# EAGLE design Controller (EAGLE 7.7.0)
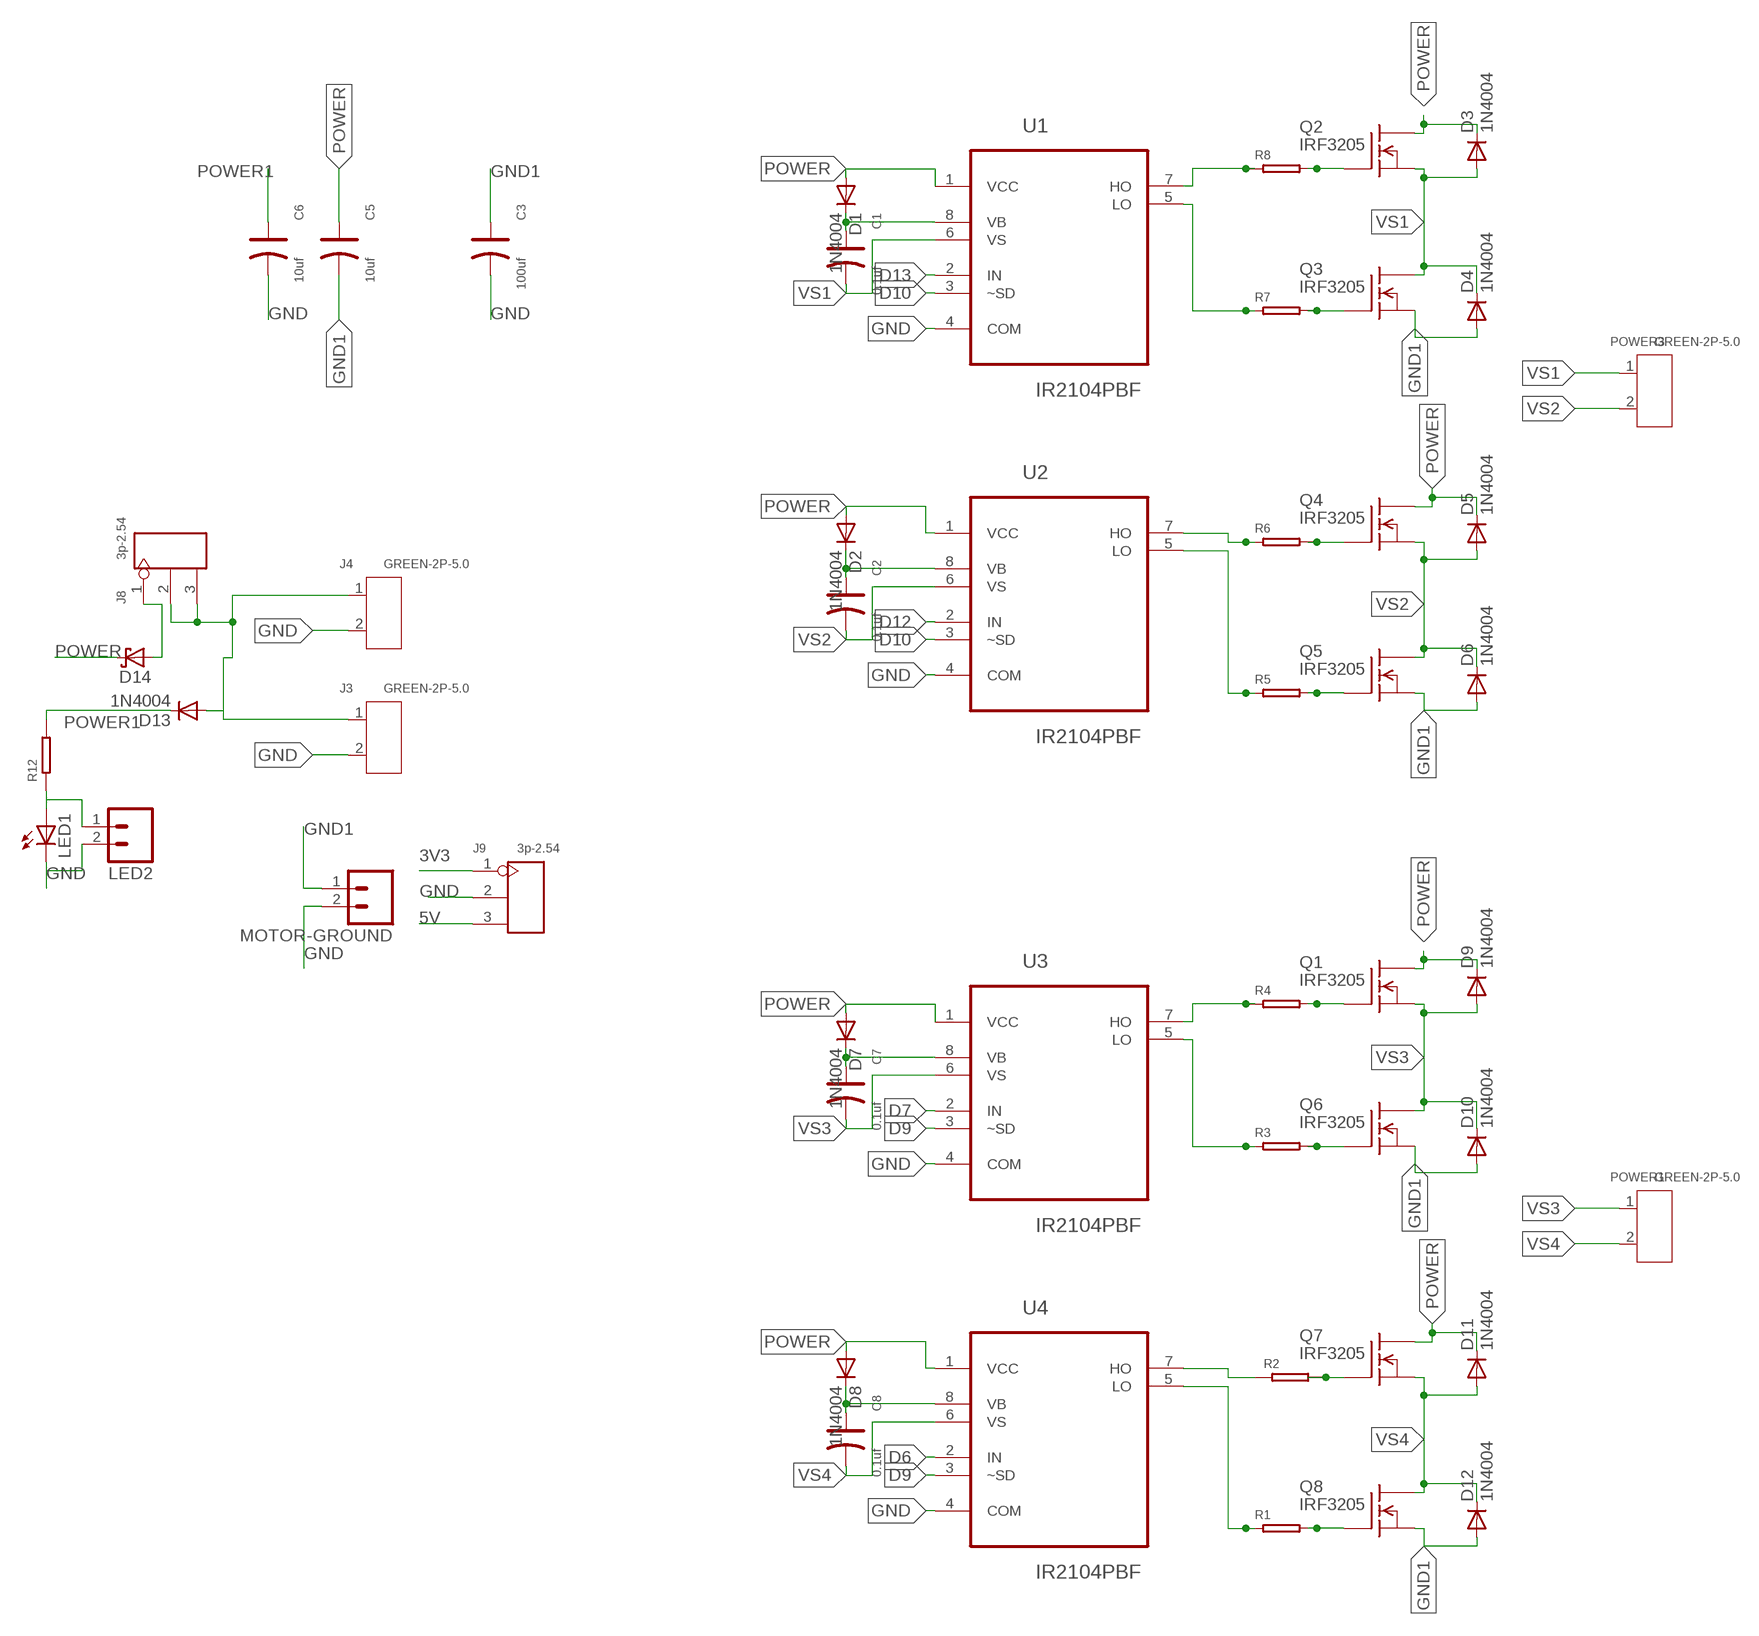
[diagram p0: schematic, sheet 1, part 1 of 2]
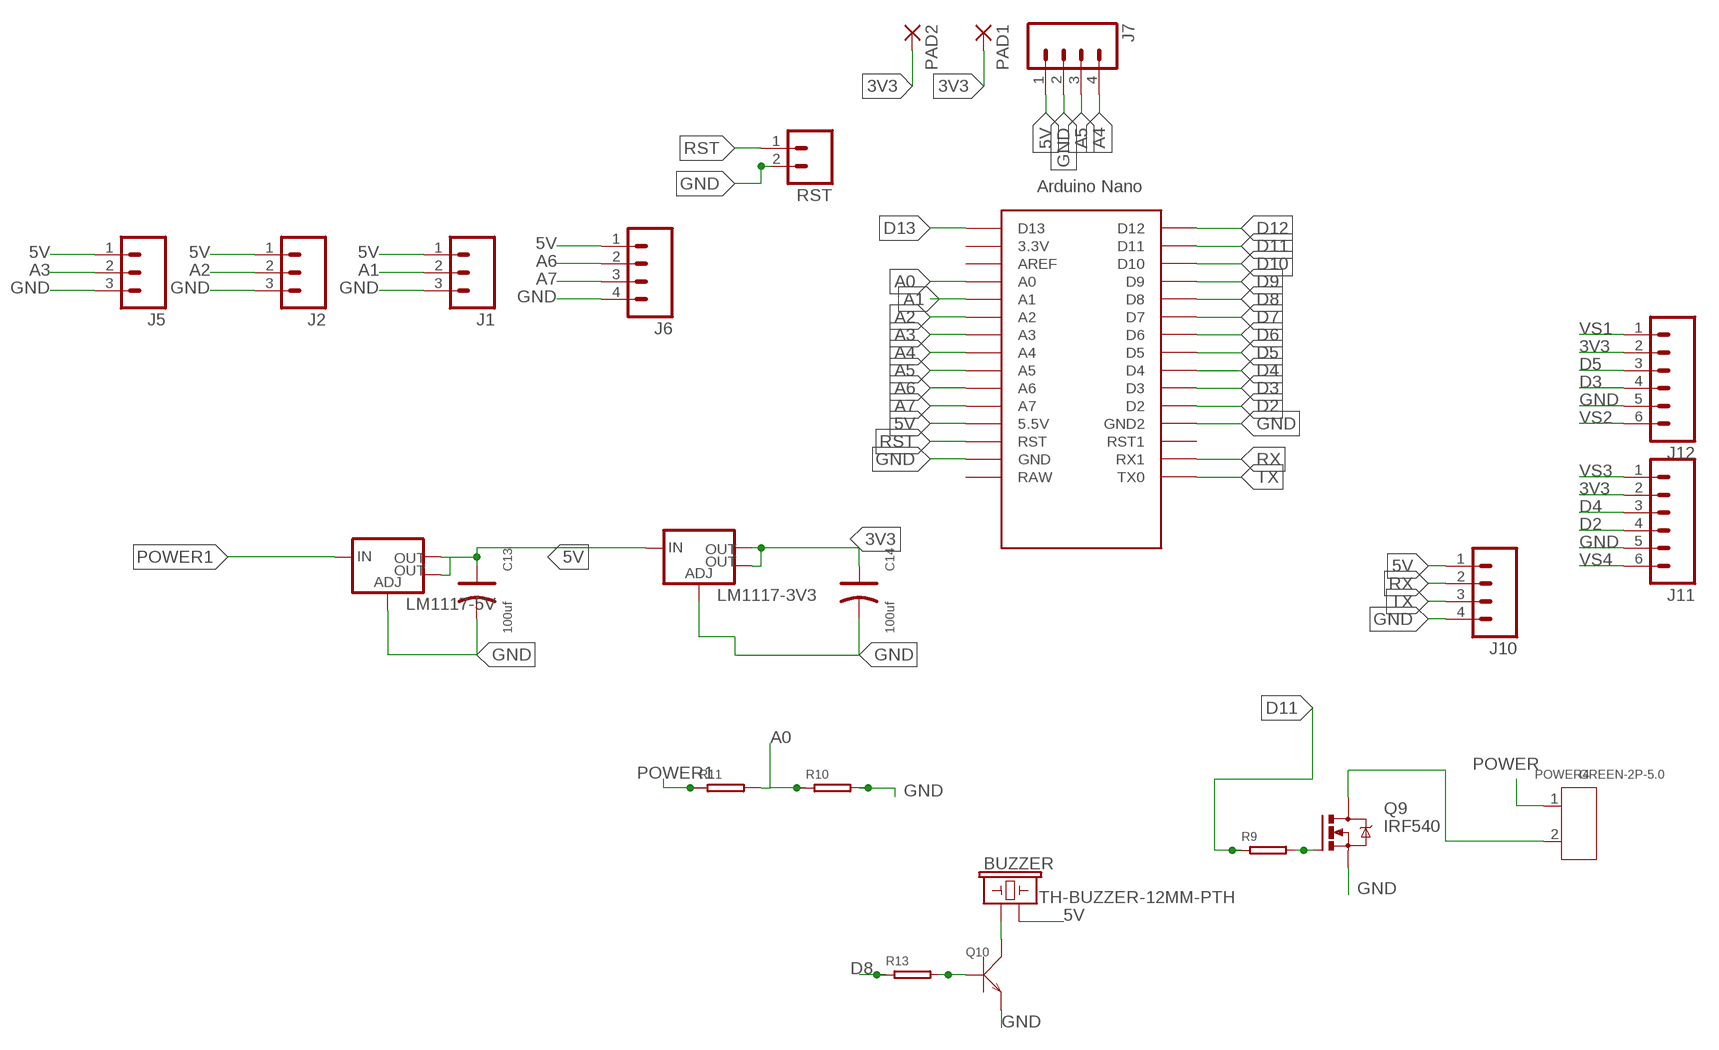
[diagram p1: schematic, sheet 1, part 2 of 2]

## Parts
BUZZER  TH-BUZZER-12MM-PTH  [BUZZER-12MM]
C1  0.1uf  DIP-ALUMINUM-100UF-16V(D5-H7MM)  [PC-D5.3MM]
C2  0.1uf  DIP-ALUMINUM-100UF-16V(D5-H7MM)  [PC-D5.3MM]
C3  100uf  DIP-ALUMINUM-100UF-16V(D5-H7MM)  [PC-D5.3MM]
C5  10uf  DIP-ALUMINUM-100UF-16V(D5-H7MM)  [PC-D5.3MM]
C6  10uf  DIP-ALUMINUM-100UF-16V(D5-H7MM)  [PC-D5.3MM]
C7  0.1uf  DIP-ALUMINUM-100UF-16V(D5-H7MM)  [PC-D5.3MM]
C8  0.1uf  DIP-ALUMINUM-100UF-16V(D5-H7MM)  [PC-D5.3MM]
C13  100uf  DIP-ALUMINUM-100UF-16V(D5-H7MM)  [PC-D5.3MM]
C14  100uf  DIP-ALUMINUM-100UF-16V(D5-H7MM)  [PC-D5.3MM]
D1  1N4004  [DO41-10]
D2  1N4004  [DO41-10]
D3  1N4004  [DO41-10]
D4  1N4004  [DO41-10]
D5  1N4004  [DO41-10]
D6  1N4004  [DO41-10]
D7  1N4004  [DO41-10]
D8  1N4004  [DO41-10]
D9  1N4004  [DO41-10]
D10  1N4004  [DO41-10]
D11  1N4004  [DO41-10]
D12  1N4004  [DO41-10]
D13  1N4004  [DO41-10]
D14  SCHOTTKY-DIODEDO201T15  [DO201T15]
J1  M03POLAR  [MOLEX-1X3]
J2  M03POLAR  [MOLEX-1X3]
J3  GREEN-2P-5.0  SCREW-TERMINAL-GREEN(2P-5.0)  [H2-5.0-10.5X8.0MM]
J4  GREEN-2P-5.0  SCREW-TERMINAL-GREEN(2P-5.0)  [H2-5.0-10.5X8.0MM]
J5  M03POLAR  [MOLEX-1X3]
J6  M04POLAR  [MOLEX-1X4]
J7  M04POLAR  [MOLEX-1X4]
J8  3p-2.54  DIP-BLACK-FEMALE-HEADER-VERT(3P-2.54)  [H3-2.54]
J9  3p-2.54  DIP-BLACK-FEMALE-HEADER-VERT(3P-2.54)  [H3-2.54]
J10  M04POLAR  [MOLEX-1X4]
J11  M06POLAR  [MOLEX-1X6]
J12  M06POLAR  [MOLEX-1X6]
LED1  LEDCHIPLED_0603  [CHIPLED_0603]
LED2  M02PTH  [1X02]
LM1117-3V3  V_REG_LM1117SOT223  [SOT223]
LM1117-5V  V_REG_LM1117SOT223  [SOT223]
MOTOR-GROUND  M02PTH  [1X02]
PAD1  2,15/1,0  [2,15/1,0]
PAD2  2,15/1,0  [2,15/1,0]
POWER1  GREEN-2P-5.0  SCREW-TERMINAL-GREEN(2P-5.0)  [H2-5.0-10.5X8.0MM]
POWER3  GREEN-2P-5.0  SCREW-TERMINAL-GREEN(2P-5.0)  [H2-5.0-10.5X8.0MM]
POWER4  GREEN-2P-5.0  SCREW-TERMINAL-GREEN(2P-5.0)  [H2-5.0-10.5X8.0MM]
Q1  IRF3205  IRF540  [TO220]
Q2  IRF3205  IRF540  [TO220]
Q3  IRF3205  IRF540  [TO220]
Q4  IRF3205  IRF540  [TO220]
Q5  IRF3205  IRF540  [TO220]
Q6  IRF3205  IRF540  [TO220]
Q7  IRF3205  IRF540  [TO220]
Q8  IRF3205  IRF540  [TO220]
Q9  IRF540  [TO220BV]
Q10  SMD-TRANSISTOR-NPN-SOT-23  [SOT-23]
R1  SMD-RESISTOR-0603  [R0603]
R2  SMD-RESISTOR-0603  [R0603]
R3  SMD-RESISTOR-0603  [R0603]
R4  SMD-RESISTOR-0603  [R0603]
R5  SMD-RESISTOR-0603  [R0603]
R6  SMD-RESISTOR-0603  [R0603]
R7  SMD-RESISTOR-0603  [R0603]
R8  SMD-RESISTOR-0603  [R0603]
R9  SMD-RESISTOR-0603  [R0603]
R10  SMD-RESISTOR-0603  [R0603]
R11  SMD-RESISTOR-0603  [R0603]
R12  SMD-RESISTOR-0603  [R0603]
R13  SMD-RESISTOR-0603  [R0603]
RST  M02PTH  [1X02]
U1  IR2104PBF  [DIP254P762X533-8]
U2  IR2104PBF  [DIP254P762X533-8]
U3  IR2104PBF  [DIP254P762X533-8]
U4  IR2104PBF  [DIP254P762X533-8]
U$1  NANO  [NANO]

## Nets
3V3: C14.+ J9.1 J11.2 J12.2 LM1117-3V3.2(OUT) LM1117-3V3.4(OUT) PAD1.1(P) PAD2.1(P)
5V: BUZZER.- C13.+ J1.1 J2.1 J5.1 J6.1 J7.1 J9.3 J10.1 LM1117-3V3.3(IN) LM1117-5V.2(OUT) LM1117-5V.4(OUT) U$1.5V(5.5V)
A0: R10.1 R11.2 U$1.A0
A1: J1.2 U$1.A1
A2: J2.2 U$1.A2
A3: J5.2 U$1.A3
A4: J7.4 U$1.A4
A5: J7.3 U$1.A5
A6: J6.2 U$1.A6
A7: J6.3 U$1.A7
D2: J11.4 U$1.D2
D3: J12.4 U$1.D3
D4: J11.3 U$1.D4
D5: J12.3 U$1.D5
D6: U4.2(IN) U$1.D6
D7: U3.2(IN) U$1.D7
D8: R13.1 U$1.D8
D9: U3.3(~SD) U4.3(~SD) U$1.D9
D10: U1.3(~SD) U2.3(~SD) U$1.D10
D11: R9.1 U$1.D11
D12: U2.2(IN) U$1.D12
D13: U1.2(IN) U$1.D13
GND: C3.- C6.- C13.- C14.- J1.3 J2.3 J3.2 J4.2 J5.3 J6.4 J7.2 J9.2 J10.4 J11.5 J12.5 LED1.C LED2.2 LM1117-3V3.1(ADJ) LM1117-5V.1(ADJ) MOTOR-GROUND.2 Q9.S Q10.2(E) R10.2 RST.2 U1.4(COM) U2.4(COM) U3.4(COM) U4.4(COM) U$1.GND U$1.GND1(GND2)
GND1: C3.+ C5.- D4.A D6.A D10.A D12.A MOTOR-GROUND.1 Q3.3(S) Q5.3(S) Q6.3(S) Q8.3(S)
N$1: Q3.1(G) R7.2
N$2: C1.+ D1.C U1.8(VB)
N$3: Q4.1(G) R6.2
N$4: C2.+ D2.C U2.8(VB)
N$5: Q5.1(G) R5.2
N$6: Q2.1(G) R8.2
N$7: R8.1 U1.7(HO)
N$8: R7.1 U1.5(LO)
N$9: R6.1 U2.7(HO)
N$10: R5.1 U2.5(LO)
N$11: C7.+ D7.C U3.8(VB)
N$12: C8.+ D8.C U4.8(VB)
N$13: Q7.1(G) R2.2
N$14: Q8.1(G) R1.2
N$15: Q1.1(G) R4.2
N$16: R4.1 U3.7(HO)
N$17: R3.1 U3.5(LO)
N$18: R2.1 U4.7(HO)
N$19: R1.1 U4.5(LO)
N$20: Q6.1(G) R3.2
N$21: D13.A J3.1 J4.1 J8.2 J8.3
N$22: Q9.G R9.2
N$23: LED1.A LED2.1 R12.1
N$24: POWER4.2 Q9.D
N$25: Q10.1(B) R13.2
N$26: BUZZER.+ Q10.3(C)
N$28: D14.A J8.1
POWER: C5.+ D1.A D2.A D3.C D5.C D7.A D8.A D9.C D11.C D14.C POWER4.1 Q1.2(D) Q2.2(D) Q4.2(D) Q7.2(D) U1.1(VCC) U2.1(VCC) U3.1(VCC) U4.1(VCC)
POWER1: C6.+ D13.C LM1117-5V.3(IN) R11.1 R12.2
RST: RST.1 U$1.RST
RX: J10.2 U$1.RX1
TX: J10.3 U$1.TX0
VS1: C1.- D3.A D4.C J12.1 POWER3.1 Q2.3(S) Q3.2(D) U1.6(VS)
VS2: C2.- D5.A D6.C J12.6 POWER3.2 Q4.3(S) Q5.2(D) U2.6(VS)
VS3: C7.- D9.A D10.C J11.1 POWER1.1 Q1.3(S) Q6.2(D) U3.6(VS)
VS4: C8.- D11.A D12.C J11.6 POWER1.2 Q7.3(S) Q8.2(D) U4.6(VS)
Unconnected: U$1.3.3V U$1.AREF U$1.RAW U$1.RST1

## Library data of the parts
BUZZER = EjaadTech:TH-BUZZER-12MM
C1 C2 C5-C8 = Seeed-Capacitor-2016:DIP-ALUMINUM-100UF-16V(D5-H7MM): 302030031; MPN: KS 100uF/16V; VALUE: 100uf
C3 C13 C14 = Seeed-Capacitor-2016:DIP-ALUMINUM-100UF-16V(D5-H7MM): 302030031; MPN: KS 100uF/16V
D1-D13 = adafruit:1N4004: DIODE General purpose 1N400x type rectifier (With bigger pads) http://www.ladyada.net/library/pcb/eaglelibrary.html
D14 = adafruit:SCHOTTKY-DIODE: Schottky Diode
J1 J2 J5 = SparkFun-Connectors:M03: Header 3 Standard 3-pin 0.1" header. Use with straight break away headers (SKU : PRT-00116), right angle break away headers (PRT-00553), swiss pins (PRT-00743), machine pins (PRT-00117), and female headers (PRT-00115). Molex polarized connector foot print use with SKU : PRT-08232 with associated crimp pins and housings.
J3 J4 = Seeed-OPL-Connector:SCREW-TERMINAL-GREEN(2P-5.0): 320110031
J6 J7 J10 = SparkFun-Connectors:M04: Header 4 Standard 4-pin 0.1" header. Use with straight break away headers (SKU : PRT-00116), right angle break away headers (PRT-00553), swiss pins (PRT-00743), machine pins (PRT-00117), and female headers (PRT-00115). Molex polarized connector foot print use with SKU : PRT-08231 with associated crimp pins and housings. 1MM SMD Version SKU: PRT-10208
J8 J9 = Seeed-OPL-Connector:DIP-BLACK-FEMALE-HEADER-VERT(3P-2.54): 320030024; MPN: F185-1103A0BSYA1
J11 J12 = SparkFun-Connectors:M06: Header 6 Standard 6-pin 0.1" header. Use with straight break away headers (SKU : PRT-00116), right angle break away headers (PRT-00553), swiss pins (PRT-00743), machine pins (PRT-00117), and female headers (PRT-00115). Molex polarized connector foot print use with SKU : PRT-08094 with associated crimp pins and housings. NOTES ON THE VARIANTS LOCK and LOCK_LONGPADS... This footprint was designed to help hold the alignment of a through-hole component (i.e. 6-pin header) while soldering it into place. You may notice that each hole has been shifted either up or down by 0.005 of an inch from it's more standard position (which is a perfectly straight line). This slight alteration caused the pins (the squares in the middle) to touch the edges of the holes. Because they are alternating, it causes a "brace" to hold the component in place. 0.005 has proven to be the perfect amount of "off-center" position when using our standard breakaway headers. Although looks a little odd when you look at the bare footprint, once you have a header in there, the alteration is very hard to notice. Also,if you push a header all the way into place, it is covered up entirely on the bottom side. This idea of altering the position of holes to aid alignment will be further integrated into the Sparkfun Library for other footprints. It can help hold any component with 3 or more connection pins.
LED1 = adafruit:LED: LED OSRAM: - CHIPLED LG R971, LG N971, LY N971, LG Q971, LY Q971, LO R971, LY R971 LH N974, LH R974 LS Q976, LO Q976, LY Q976 LO Q996 - Hyper CHIPLED LW Q18S LB Q993, LB Q99A, LB R99A - SideLED LS A670, LO A670, LY A670, LG A670, LP A670 LB A673, LV A673, LT A673, LW A673 LH A674 LY A675 LS A676, LA A676, LO A676, LY A676, LW A676 LS A679, LY A679, LG A679 - Hyper Micro SIDELED® LS Y876, LA Y876, LO Y876, LY Y876 LT Y87S - SmartLED LW L88C, LW L88S LB L89C, LB L89S, LG L890 LS L89K, LO L89K, LY L89K LS L896, LA L896, LO L896, LY L896 - TOPLED LS T670, LO T670, LY T670, LG T670, LP T670 LSG T670, LSP T670, LSY T670, LOP T670, LYG T670 LG T671, LOG T671, LSG T671 LB T673, LV T673, LT T673, LW T673 LH T674 LS T676, LA T676, LO T676, LY T676, LB T676, LH T676, LSB T676, LW T676 LB T67C, LV T67C, LT T67C, LS T67K, LO T67K, LY T67K, LW E67C LS E67B, LA E67B, LO E67B, LY E67B, LB E67C, LV E67C, LT E67C LW T67C LS T679, LY T679, LG T679 LS T770, LO T770, LY T770, LG T770, LP T770 LB T773, LV T773, LT T773, LW T773 LH T774 LS E675, LA E675, LY E675, LS T675 LS T776, LA T776, LO T776, LY T776, LB T776 LHGB T686 LT T68C, LB T68C - Hyper Mini TOPLED® LB M676 - Mini TOPLED Santana® LG M470 LS M47K, LO M47K, LY M47K Source: http://www.osram.convergy.de/
LED2 MOTOR-GROUND RST = SparkFun-Connectors:M02: Standard 2-pin 0.1" header. Use with - straight break away headers ( PRT-00116) - right angle break away headers (PRT-00553) - swiss pins (PRT-00743) - machine pins (PRT-00117) - female headers (PRT-00115) Molex polarized connector foot print use with: PRT-08233 with associated crimp pins and housings. 2.54_SCREWTERM for use with PRT-10571. 3.5mm Screw Terminal footprints for PRT-08084 5mm Screw Terminal footprints for use with PRT-08432
LM1117-3V3 LM1117-5V = SparkFun-PowerIC:V_REG_LM1117: Voltage Regulator LM1117 Standard adjustable voltage regulator but in SMD form. Spark Fun Electronics SKU : COM-00595; PROD_ID: VREG-08170
PAD1 PAD2 = wirepad:2,15/1,0: THROUGH-HOLE PAD
POWER1 POWER3 POWER4 = Seeed-Connector -2016:SCREW-TERMINAL-GREEN(2P-5.0): 320110031
Q1-Q8 = transistor-fet:IRF540: N-Channel Enhancement MOSFET (HEXFET); 100V; 28A; 0,077Ohm
Q9 = transistor-power:IRF540: HEXFET Power MOSFET
Q10 = EjaadTech:SMD-TRANSISTOR-NPN-SOT-23
R1-R13 = EjaadTech:SMD-RESISTOR-0603
U1-U4 = International_Rectifier_By_element14_Batch_1:IR2104PBF: HALF BRIDGE DRIVER; MPN: IR2104PBF; OC_FARNELL: 8638748; OC_NEWARK: 63J7843; PACKAGE: PDIP; SUPPLIER: INTERNATIONAL RECTIFIER
U$1 = Arduino-clone:NANO: Arduino Nano

## Board
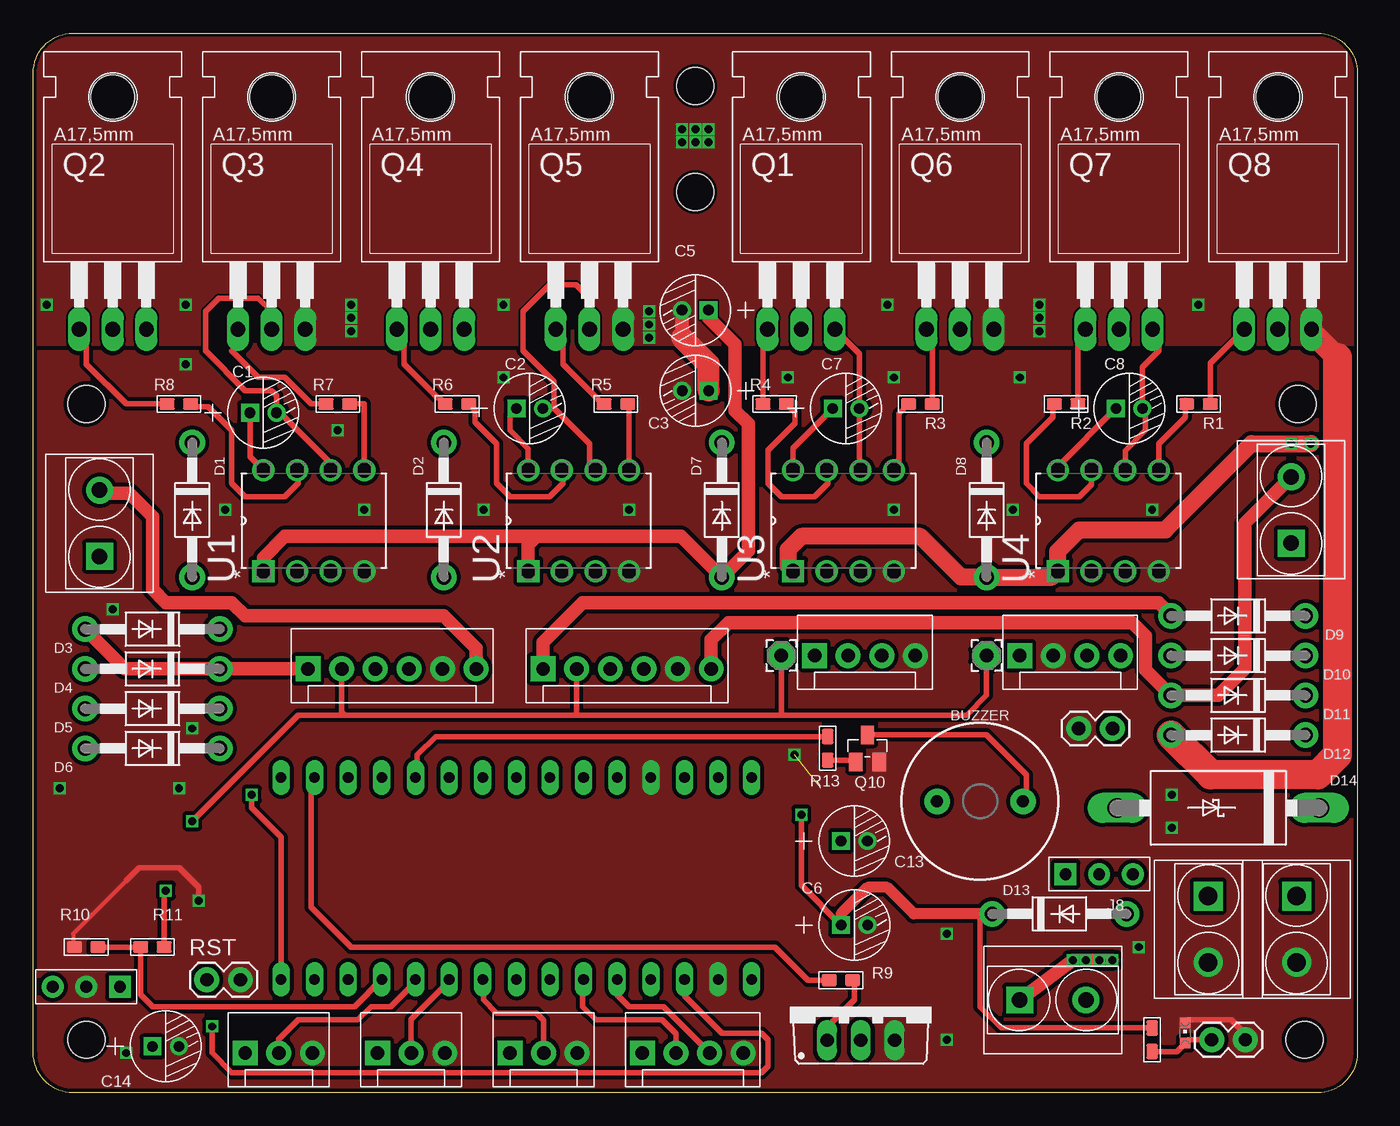
[diagram p2: board, top side]
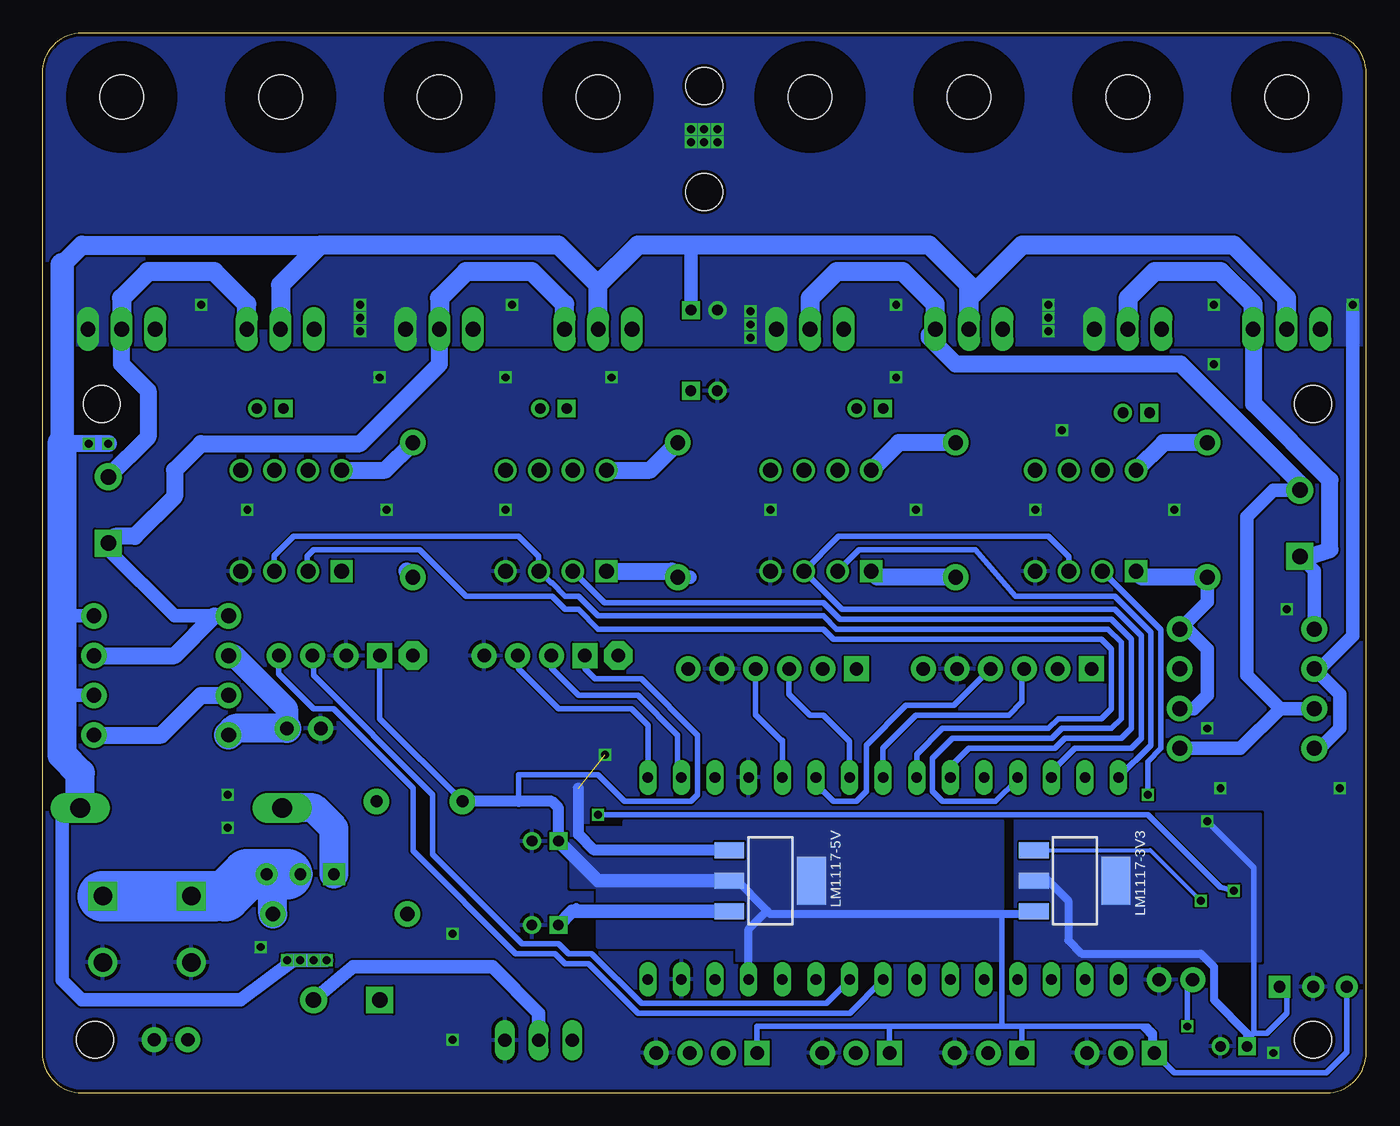
[diagram p3: board, bottom side, seen from below]

Size 100 x 80 mm. Coordinates in mm from the lower left corner, seen from the top.
Outline: 97,80 arc-90 100,77 100,3 arc-90 97,0 3,0 arc-90 0,3 0,77 arc-90 3,80 97,80
Copper layers (1*16): Top 0.035mm / dielectric 1.5mm / Bottom 0.035mm
Design rules "SeeedStudio_2layer_DRU_no_angle_20140221": minimum track width 6mil, minimum drill 12mil, track to track 6mil, track to pad 6mil, pad to pad 6mil, via to via 6mil, smd to smd 0mil, copper to edge 10mil, drill to drill 10mil, minimum pad ring 10mil, minimum via ring 6mil, stop-mask expansion 2mil, vias tented up to drill 100mil, thermal gap 10mil
Holes 2.8 mm at 4,52 95.5,52 50,76 50,68 96,4 4,4

### Footprints (pad centres in the part's own frame; a part is rotated, then mirrored left to right if it is on the bottom)
BUZZER-12MM = drill 0.9 pad 1.93: + 3.25,0; - -3.25,0
PC-D5.3MM = drill 0.8 pad 1.35 square: + -1,0 | drill 0.8 pad 1.35: - 1,0
DO41-10 = drill 1.118 pad 1.93: A 5.08,0; C -5.08,0
DO201T15 = drill 1.499 long: A 7.62,0; C -7.62,0
MOLEX-1X3 = drill 1.016 pad 1.88 square: 1 0,0 | drill 1.016 pad 1.88: 2 2.54,0; 3 5.08,0
H2-5.0-10.5X8.0MM = drill 1.4 pad 2.184 square: 1 0,2.5 | drill 1.4 pad 2.184: 2 0,-2.5
MOLEX-1X4 = drill 1.016 pad 1.88 square: 1 0,0 | drill 1.016 pad 1.88: 2 2.54,0; 3 5.08,0; 4 7.62,0
H3-2.54 = drill 0.889 pad 1.651 square: 1 0,2.54 | drill 0.889 pad 1.651: 2 0,0; 3 0,-2.54
MOLEX-1X6 = drill 1.016 pad 1.88 square: 1 0,0 | drill 1.016 pad 1.88: 2 2.54,0; 3 5.08,0; 4 7.62,0; 5 10.16,0; 6 12.7,0
CHIPLED_0603 = smd 0.8 x 0.8: A 0,-0.75; C 0,0.75
1X02 = drill 1.016 pad 1.88: 1 0,0; 2 2.54,0
SOT223 = smd 1.219 x 2.235: 1 -2.311,-3.099; 2 0,-3.099; 3 2.311,-3.099 | smd 3.6 x 2.2: 4 0,3.099
2,15/1,0 = drill 1.016 pad 2.159 octagon: 1 0,0
H2-5.0-10.5X8.0MM' = drill 1.168 pad 2.032 square: 1 0,2.5 | drill 1.168 pad 2.032: 2 0,-2.5
TO220 = drill 1.118 long: 1 -2.54,-6.35; 2 0,-6.35; 3 2.54,-6.35 | hole 3.302: 0,11.176
TO220BV = drill 1.016 long: D 0,-2.54; G -2.54,-2.54; S 2.54,-2.54
SOT-23 = smd 1.016 x 1.397: 1 -0.889,-1.016; 2 0.889,-1.016; 3 0,1.016
R0603 = smd 0.889 x 1.143: 1 0,0.889; 2 0,-0.889
DIP254P762X533-8 = drill 1.118 square: 1 -7.62,7.62 | drill 1.118: 2 -7.62,5.08; 3 -7.62,2.54; 4 -7.62,0; 5 0,0; 6 0,2.54; 7 0,5.08; 8 0,7.62
NANO = drill 0.8 long: 3.3V -10.16,24.13; 5V -10.16,-1.27; A0 -10.16,19.05; A1 -10.16,16.51; A2 -10.16,13.97; A3 -10.16,11.43; A4 -10.16,8.89; A5 -10.16,6.35; A6 -10.16,3.81; A7 -10.16,1.27; AREF -10.16,21.59; D2 5.08,1.27; D3 5.08,3.81; D4 5.08,6.35; D5 5.08,8.89; D6 5.08,11.43; D7 5.08,13.97; D8 5.08,16.51; D9 5.08,19.05; D10 5.08,21.59; D11 5.08,24.13; D12 5.08,26.67; D13 -10.16,26.67; GND -10.16,-6.35; GND1 5.08,-1.27; RAW -10.16,-8.89; RST -10.16,-3.81; RST1 5.08,-3.81; RX1 5.08,-6.35; TX0 5.08,-8.89

### Placement (x,y rotation side)
BUZZER  71.5,22 0 top
C1  17.37,51.34 0 top
C2  37.49,51.66 0 top
C3  50,53 180 top
C5  49.99,59.09 180 top
C6  62.01,12.66 0 top
C7  61.39,51.66 0 top
C8  82.77,51.66 0 top
C13  62,19 0 top
C14  10,3.5 0 top
D1  12,44 270 top
D2  31,44 270 top
D3  9,35 180 top
D4  9,32 180 top
D5  9,29 180 top
D6  9,26 180 top
D7  52,44 270 top
D8  72,44 270 top
D9  91,36 180 top
D10  91,33 180 top
D11  91,30 180 top
D12  91,27 180 top
D13  77.5,13.5 0 top
D14  89.5,21.5 180 top
J1  16,3 0 top
J2  26,3 0 top
J3  88.74,12.34 0 top
J4  95.42,12.34 0 top
J5  36,3 0 top
J6  46,3 0 top
J7  74.5,33 0 top
J8  80.5,16.5 90 top
J9  4,8 270 top
J10  59,33 0 top
J11  38.5,32 0 top
J12  20.75,32 0 top
LED1  87,4.5 0 top
LED2  89,4 0 top
LM1117-3V3  22,16 270 bottom
LM1117-5V  45,16 270 bottom
MOTOR-GROUND  81.5,27.5 180 top
PAD1  56.5,33 0 top
PAD2  72,33 0 top
POWER1  GREEN-2P-5.0  [H2-5.0-10.5X8.0MM']  95,44 180 top
POWER3  GREEN-2P-5.0  [H2-5.0-10.5X8.0MM']  5,43 180 top
POWER4  GREEN-2P-5.0  [H2-5.0-10.5X8.0MM']  77,7 90 top
Q1  58,64 0 top
Q2  6,64 0 top
Q3  18,64 0 top
Q4  30,64 0 top
Q5  42,64 0 top
Q6  70,64 0 top
Q7  82,64 0 top
Q8  94,64 0 top
Q9  62.5,6.5 0 top
Q10  63,26 0 top
R1  88,52 90 top
R2  78,52 90 top
R3  67,52 90 top
R4  56,52 270 top
R5  44,52 270 top
R6  32,52 270 top
R7  23,52 270 top
R8  11,52 270 top
R9  61,8.5 90 top
R10  4,11 270 top
R11  9,11 270 top
R12  84.5,4 180 top
R13  60,26 0 top
RST  13.1,8.53 0 top
U1  25,47 90 top
U2  45,47 90 top
U3  65,47 90 top
U4  85,47 90 top
U$1  45.37,18.72 90 top

### Tracks (layer width: path | path; a pad name or v marks a point on that pad's centre or on a via)
3V3  (via drill 0.6)
  Top 0.406: v12,20.5 20,28.5 23.5,28.5 | 23.5,28.5 41,28.5 | 41,28.5 56.5,28.5 | 56.5,28.5 70.5,28.5 72,30 PAD2.1 | PAD1.1 56.5,28.5 | J11.2 41.04,28.54 41,28.5 | J12.2 23.29,28.71 23.5,28.5
  Bottom 0.406: v12,20.5 8.5,17 8.5,4.5 | 8.5,4.5 9,4 | 8.5,4.5 7.5,4.5 6,6 6,7.46 J9.1
  Bottom 0.61: 24,16 22.5,14.5 22.5,11.5 21.5,10.5 12.5,10.5 11.5,9.5 11.5,7 9,4.5 9,4 C14.+ | 24.3,16.3 24,16 | 24,16 LM1117-3V3.2
  pour Bottom (no thermals): 26.5,21 26.5,10 8,10 8,21
5V
  Bottom 0.406: J6.1 46,5 36,5 | 16,4 17,5 | 26,5 16.5,5 16.25,4.75 | 27.5,5 36,5 | J2.1 26,5 | J5.1 36,5 | 16.25,4.75 16,4.5 16,4 | 26,5 27.5,5 | 27.5,5 27.5,13.5 | 16,4 J1.1 14.5,1.5 3,1.5 1.46,3.04 J9.3 | 64,22 64,24 61,24 58,24 56,22 51,22 50.5,22.5 50.5,27 54.75,31.25 58.25,31.25 59,32 J10.1 | 16,4 16.25,4 16.25,4.75 | 68.5,22.25 BUZZER.- 74.5,28.25 J7.1
  Bottom 0.61: 58.3,16.3 C13.+ | 47.8,16.3 45.25,13.75 | 45.25,13.75 45,13.5 27.5,13.5 25.29,13.5 LM1117-3V3.3 | U$1.5V 46.64,12.36 45.25,13.75
  Bottom 0.813: C13.+ 61,21.5 61.5,22 64,22 BUZZER.-
  Bottom 1.016: LM1117-5V.2 58,16 C13.+
  pour Bottom (no thermals): 56,20.5 27.5,20.5 27.5,10 47.5,10 47.5,11 58,11 58,15.5 60,15.5 60,20 56,20
A0
  Top 0.406: R10.1 R11.2 8.11,7.39 9,6.5 24.26,6.5 U$1.A0
A1
  Top 0.406: J1.2 18.54,4.04 20,5.5 24.5,5.5 25.5,6.5 27,6.5 28.5,8 28.5,8.2 U$1.A1
A2
  Top 0.406: J2.2 28.54,5.54 31,8 31,8.16 U$1.A2
A3
  Top 0.406: J5.2 38.54,5.46 38,6 35,6 34,7 34,8.5 U$1.A3
A4
  Bottom 0.406: U$1.A4 36.48,8.52 39,6 55,6 58.75,9.75 60.5,9.75 61.25,10.5 64.25,10.5 72,18.25 72,23 78,29 79.5,29 82.12,31.62 J7.4
A5
  Bottom 0.406: U$1.A5 39.02,8.48 40.75,6.75 54.75,6.75 58.5,10.5 60.25,10.5 61,11.25 63.75,11.25 70.5,18 70.5,22.5 79.5,31.5 79.5,32.92 J7.3
A6
  Top 0.406: J6.2 48.54,4.46 47.5,5.5 42.5,5.5 41.5,6.5 41.5,8.5 U$1.A6
A7
  Top 0.406: U$1.A7 44.1,7.4 45,6.5 47.58,6.5 J6.3
D2
  Bottom 0.406: U$1.D2 44.1,26.5 | 44.1,26.5 44.1,26.6 | J11.4 46.12,28.52 44.1,26.5
D3
  Bottom 0.406: U$1.D3 41.5,23.74 41.5,23 41.25,22.75 41,22.75 40.25,22 38.5,22 37.75,22.75 37.75,26.25 34.75,29.25 31.12,29.25 J12.4
D4
  Bottom 0.406: U$1.D4 39.02,26.52 41,28.5 42,28.5 43.58,30.08 J11.3
D5
  Bottom 0.406: U$1.D5 36.5,23.82 36.5,26 34,28.5 27,28.5 26,29.5 26,31.83 J12.3
D6
  Bottom 0.406: U$1.D6 33.94,25.56 32,27.5 24,27.5 23.25,28.25 20,28.25 19.25,29 19.25,33.5 20,34.25 40.25,34.25 41,35 58,35 59.5,36.5 60.5,36.5 61.5,37.5 68,37.5 71.5,41 79.5,41 80,40.5 80,39.46 U4.2 80,39.3
D7
  Bottom 0.406: U$1.D7 31.4,24.6 30,26 23.5,26 22.75,26.75 18.5,26.75 17.75,27.5 17.75,34.25 19.25,35.75 39.75,35.75 41,37 57.54,37 U3.2
D8
  Top 0.406: R13.1 30.39,26.89 29,25.5 29,23.94 U$1.D8
D9
  Bottom 0.406: U$1.D9 26.32,23.68 28,22 32,22 32.75,22.75 32.75,25.25 31.25,26.75 23.75,26.75 23,27.5 19.25,27.5 18.5,28.25 18.5,34 19.5,35 40,35 41,36 58,36 59.5,37.5 60.5,37.5 61.5,38.5 61.58,38.5 U3.3 62.5,39.42 62.5,40.5 64,42 81,42 82.46,40.54 U4.3
D10
  Bottom 0.406: U$1.D10 23.78,24.22 22,26 17.75,26 17,26.75 17,34.5 19,36.5 39.58,36.5 U2.3 39.84,42 24,42 22.46,40.46 U1.3
D11
  Top 0.406: R9.1 58.5,8.5 56,11 24,11 21,14 21,23.56 U$1.D11
D12
  Bottom 0.406: 40,39.3 U2.2 38.3,41 29.5,41 26.5,37.5 19,37.5 16.25,34.75 16.25,26.25 U$1.D12
D13  (via drill 0.6)
  Top 0.406: U$1.D13 18.7,19.3 16.5,21.5 v16.5,22.5
  Bottom 0.406: v16.5,22.5 16.5,25 15.5,26 15.5,34.96 U1.2
GND  (via drill 0.6)  (1 unrouted)
  Top 0.305: 7,16 3,12 3,11.11 R10.2
  Top 0.406: LED2.2 91.54,4.46 90.5,5.5 87.25,5.5 LED1.C | v12.5,14.5 12.5,15.5 11,17 8,17 7,16
  Bottom 0.305: LM1117-3V3.1 16.31,18.31 v12.5,14.5
  Bottom 0.813: LM1117-5V.1 58.31,18.31 59.5,19.5 59.5,23
  other vias: 69,4 57.5,25.5 23,50 35.5,54 57,54 65,54 74.5,54 69,12 7,3 2,23 11,23 12,27.5 6,36.5 11.5,55 25,44 14.5,44 34,44 45,44 65,44 84.5,44 74,44 86,22.5 86,20 83.5,11
  pour Bottom (rank 3): -4,58 -4,-3.5 104.5,-3.5 104.5,57.5 -3.5,57.5 -3.5,58
  pour Top (isolate 0.305, rank 3, no thermals): -12,57.5 112,57.5 112,-6.5 -12,-6.5
GND1  (via drill 0.6)
  Top 1.016: 49,57 C5.-
  Top 1.676: Q8.3 96.54,57.46 98.5,55.5 | C3.+ 51,55 49,57
  Top 2.184: 98.5,55.5 98.5,25.5 97,24 88.92,24 D12.A
  Bottom 1.016: D6.A 3.5,26 2,27.5 2,30.08 D4.A 3.5,32 1,34.5 v1,59.5
  Bottom 1.676: D10.A 85.5,33 81.5,29 MOTOR-GROUND.1
  Bottom 2.184: MOTOR-GROUND.1 85.42,27.5 D12.A
  other vias: 11.5,59.5 24,59.5 35.5,59.5 64.5,59.5 76,59.5 88,59.5 24,58.5 24,57.5 46.5,58 46.5,57 46.5,59 76,58.5 76,57.5 49,72.75 50,72.75 51,72.75 51,71.75 50,71.75 49,71.75
  pour Top (rank 2, no thermals): -1.5,81 101,81 101,56.5 -1.5,56.5
  pour Bottom (rank 2, no thermals): -10.5,82.5 106,82.5 106,56.5 -10.5,56.5
N$1
  Top 0.406: Q3.1 15.46,56.46 15,56 17,54 19,54 21,52 R7.2
N$2
  Top 0.406: C1.+ 16.37,48.01 U1.8
  Bottom 1.27: D1.C 15.3,49.08 U1.8
N$3
  Top 0.406: Q4.1 28,57.11 28,55 30.52,52.48 30.63,52.48 R6.2
N$4
  Top 0.406: U2.8 37.38,48.62 36,50 36,51.17 C2.+
  Bottom 1.27: D2.C 35.3,49.08 U2.8
N$5
  Top 0.406: Q5.1 40,57.11 40,55 43,52 R5.2
N$6
  Top 0.406: Q2.1 4,57.11 4,55 7,52 R8.2
N$7
  Top 0.406: U1.7 20,46.92 20,46 19,45 16,45 15,46 15,50 13.21,51.79 12.1,51.79 R8.1
N$8
  Top 0.406: U1.5 25,52 R7.1
N$9
  Top 0.406: U2.7 40,46.92 40,46 39,45 36,45 35,46 35,49 33.37,50.63 33.37,51.52 R6.1
N$10
  Top 0.406: U2.5 45,51.89 R5.1
N$11
  Top 0.406: U3.8 57.38,48.65 C7.+
  Bottom 1.27: U3.8 54.08,47 D7.C
N$12
  Top 0.406: U4.8 77.38,47.27 C8.+
  Bottom 1.27: U4.8 74.08,47 D8.C
N$13
  Top 0.406: 78.85,57.04 Q7.1 78.89,57.08 R2.2
N$14
  Top 0.406: R1.2 88.89,55.08 Q8.1
N$15
  Top 0.406: 54.99,57.18 Q1.1 55,57.19 55,57 55.11,56.89 R4.2
N$16
  Top 0.406: U3.7 60,46.92 60,46 59,45 56.5,45 55.5,46 55.5,48.5 57.53,50.53 57.53,51.36 R4.1
N$17
  Top 0.406: U3.5 65.39,47.39 65.39,51.28 R3.1
N$18
  Top 0.406: R2.1 77,51.89 77,51 75,49 75,46 76,45 79,45 79.92,45.92 U4.7
N$19
  Top 0.406: U4.5 85,49 87,51 87,52.11 | 87,52.29 87,52.11 | 87,52.11 R1.1
N$20
  Top 0.406: 67.93,57.18 Q6.1 67.89,57.22 R3.2
N$21
  Bottom 1.93: 81.5,16.5 J8.2
  Bottom 2.184: D13.A 82.58,16.04 J8.3
  Bottom 2.54: 87,14.84 86.16,14.84
  Bottom 3.81: J4.1 J3.1 87,14.84 | 86.16,14.84 84.5,16.5 J8.3 81.5,16.5
N$22
  Top 0.406: Q9.G 59.96,4.96 62,7 62,8.39 R9.2
N$23
  Top 0.406: LED2.1 87.25,4 LED1.A 86.36,3.11 R12.1
N$24
  Bottom 1.016: Q9.D 62.5,6 66,9.5 76.5,9.5 POWER4.2
N$25
  Top 0.406: R13.2 61.98,25.11 Q10.1
N$26
  Top 0.406: Q10.3 71.98,27.02 75,24 75,22.25 BUZZER.+
N$28
  Bottom 2.184: J8.1 77.96,19.96 79.5,21.5 D14.A
POWER  (via drill 0.6)
  Top 1.016: 57,39.76 U3.1 | U2.1 37.38,41.38 38,42 | 38,42 48.92,42 D7.A 54,40.92 54,50.5 53,51.5 53,56.5 50.99,58.51 C5.+ | POWER4.1 v78.5,10 v81.5,10 | U1.1 17.38,40.38 19,42 38,42
  Top 1.27: 57,39.76 57,41 58,42 67,42 70.08,38.92 D8.A 76.92,38.92 77.5,39.5 | U4.1 77.38,40.88 79,42.5 85.5,42.5 92,49 v96.5,49
  Bottom 0.813: 80,64 79.5,63.5
  Bottom 1.016: D1.A 12,37.08 D3.C 13.5,35 12,33.5 12,30 13,29 D5.C | D7.A 51.08,38.92 | 81,10 85,7 97,7 98.5,8.5 98.5,20.62 97.12,22 | v81.5,10 81,10 | 81,10 v80.5,10 v79.5,10 v78.5,10 | D9.C 98.5,36 | D11.C 98.5,30 | 50.99,63.49 51.5,64 | C5.+ 50.99,63.99 51,64
  Bottom 1.27: Q2.2 6,57.5 | D1.A 16.92,38.92 U1.1 | D2.A 36.92,38.92 U2.1 | U3.1 52.46,39.38 D7.A | 72.46,39.38 D8.A | 98.5,49 v96.5,49 v95,49
  Bottom 1.422: Q2.2 6,60 10,64 26,64 30,60 Q4.2 30,61 33,64 51,64 51.5,64 55,64 58,61 | Q1.2 58,61 | 58,61 61,64 79,64 | 79,64 79.5,63.5 82,61 Q7.2 | D14.C 97.12,22 | 98.5,62.5 97,64 79,64
  Bottom 1.778: 98.5,49 98.5,62.5
  Bottom 2.184: 97.12,22 97.12,24.12 98.5,25.5 98.5,30 98.5,36 98.5,49
POWER1  (via drill 0.6)
  Top 0.406: R12.2 73.11,4.89 71.5,6.5 71.5,13.5 | v58,21 58,15.67 C6.+ | R11.1 9.89,15.14 v10,15.25
  Top 0.813: D13.C 71.5,13.5 66.5,13.5 64.5,15.5 63,15.5 61,13.5 C6.+
  Bottom 0.406: v10,15.25 11,15.5 16.5,21 v58,21
  Bottom 0.61: 59.66,14.01 C6.+
  Bottom 1.016: LM1117-5V.3 59.98,13.69 C6.+
RST  (via drill 0.6)
  Top 0.406: U$1.RST 49.18,7.32 52,4.5 55,4.5 55.5,4 55.5,2 55,1.5 15,1.5 13.5,3 v13.5,5
  Bottom 0.406: v13.5,5 13.5,8.13 RST.1
RX
  Bottom 0.406: J10.2 61.54,32.04 59.5,30 55,30 52,27 52,24.08 U$1.RX1
TX
  Bottom 0.406: U$1.TX0 54.26,27.76 55.5,29 61,29 64,32 64,32.92 J10.3
VS1
  Top 0.406: U1.6 23,47 18.66,51.34 C1.- 18.37,52.63 18,53 16,53 13,56 13,59 14,60 17,60 18,59 Q3.2
  Top 1.016: D3.A 6.92,32 D4.C J12.1
  Bottom 0.813: 4.92,40.42 POWER3.1
  Bottom 1.016: D3.A 3.92,39.42 POWER3.1
  Bottom 1.27: POWER3.1 4.25,40.5 2.75,41 2.75,46.25 8.5,52 8.5,57.61 Q2.3
  Bottom 1.422: Q2.3 8.54,59.54 11,62 16,62 18,60 Q3.2
VS2
  Top 0.406: C2.- 39.34,51.66 | 39.34,51.66 42,49 42,47.46 U2.6 | 39.34,51.66 39.34,53.66 37,56 37,59 39,61 41,61 42,60 Q5.2
  Top 1.016: POWER3.2 5.25,45.25 7.25,45.25 9,43.5 9,38 10,37 15,37 16,36 31,36 33.45,33.55 J12.6
  Bottom 1.016: POWER3.2 7,45.5 9,43.5 9,31.5 6.5,29 | 6.5,29 D5.A | D6.C 9.5,26 6.5,29
  Bottom 1.27: POWER3.2 5,46 14,55 31,55 33,57 33,57.19 Q4.3
  Bottom 1.422: Q4.3 32.54,59.54 35,62 40,62 42,60 Q5.2
VS3
  Top 0.406: U3.6 63,47 62.39,47.61 C7.- 62.39,55.8 Q1.3
  Top 1.016: J11.1 38.5,34 41.25,36.75 41.5,37 85,37 85.92,36.08 D9.A
  Bottom 0.813: D9.A 87,36
  Bottom 1.016: POWER1.1 95,41 90,36 D9.A
  Bottom 1.27: Q6.2 70,55 76,49 88,49 90,47 90,45 93,42 94.5,42 POWER1.1 | D10.C 90,33 87,36
  Bottom 1.422: Q1.3 60.54,59.54 63,62 68,62 70,60 Q6.2
VS4
  Top 0.406: U4.6 82.46,48.46 84,50 84,51.43 C8.- 83.77,54.77 85,56 85,57.19 Q7.3
  Top 1.016: POWER1.2 91.5,43 91.5,32 89.5,30 D11.A 84,31.92 84,34.5 83,35.5 52.5,35.5 51.2,34.2 J11.6
  Bottom 0.813: POWER1.2 95,46
  Bottom 1.27: Q8.2 94,55 92,53 92,49.5 POWER1.2 | D12.C 91,27 88,30 D11.A
  Bottom 1.422: Q7.3 84.54,59.54 87,62 92,62 94,60 Q8.2

### Text on the board
silktop: 0K1 | 0K1 | 0K1 | 0K1 | 0K1 | 0K1 | 0K1 | MOTOR-1 OUT | OUT | OUT | OUT | OUT | OUT | OUT | IR2104 | IR2104 | IR2104 | IR2104 | MOTOR-2 OUT | OUT | OUT | D10 | D12 | D10 | D7 | D9 | D6 | D9 | D13 | PWM1 | 3V | D5 | D3 | GND | IN2 | 3V | PWM1 | D4 | D2 | GND | IN3 | PWM2 | SERIAL | I2C | IN4 | PWM2 | 3V3 | 5V | TX | RX | GND | 3V3 | 5V | GND | SCL | SDA | ENCODER-1 | ENCODER-2 | M1 / OUT1 | M1 / OUT2 | M2 / OUT1 | M2 / OUT2 | D8 | MOTOR GROUND / JUMPER | 1K | 3A-5A | MOTOR / FUSE | USB / INSERT | ARDUINO NANO | 12V | 12V | 1K | VDR / A0 | 10K | 12V | GND | D11 | GND | GND | 1K | MOSFET / CONTROL | 5V | GND | 3V3 | 5V | A1 | GND | 5V | A2 | GND | 5V | A3 | GND | 5V | A6 | A7 | GND | 10uf | 12V | GND | LED | LED | 1K | IRLB8743 | PWM CONTROLLED
silkbottom: https://github.com/maazmobin/Nano-Robot-Controller | #MOTOR-1 DRIVE / D13 D12 D10 / #MOTOR-2 DRIVE / D7 D6 D9 | 0K1 | # ALL I/0 ARE OF 5V